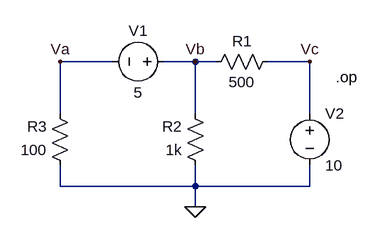
[diagram p0: schematic MNA_Voltage_Test.asc]
MNA_Voltage_Test.asc, the LTspice schematic file:
Version 4.1
SHEET 1 880 680
WIRE 112 96 32 96
WIRE 240 96 192 96
WIRE 272 96 240 96
WIRE 416 96 352 96
WIRE 32 176 32 96
WIRE 240 176 240 96
WIRE 416 176 416 96
WIRE 32 288 32 256
WIRE 240 288 240 256
WIRE 240 288 32 288
WIRE 416 288 416 256
WIRE 416 288 240 288
WIRE 240 320 240 288
FLAG 240 320 0
FLAG 32 96 Va
FLAG 240 96 Vb
FLAG 416 96 Vc
SYMBOL voltage 208 96 R90
WINDOW 0 -32 56 VBottom 2
WINDOW 3 32 56 VTop 2
WINDOW 123 0 0 Left 0
WINDOW 39 0 0 Left 0
SYMATTR InstName V1
SYMATTR Value 5
SYMBOL voltage 416 160 R0
WINDOW 123 0 0 Left 0
WINDOW 39 0 0 Left 0
SYMATTR InstName V2
SYMATTR Value 10
SYMBOL res 368 80 R90
WINDOW 0 0 56 VBottom 2
WINDOW 3 32 56 VTop 2
SYMATTR InstName R1
SYMATTR Value 500
SYMBOL res 256 272 R180
WINDOW 0 36 76 Left 2
WINDOW 3 36 40 Left 2
SYMATTR InstName R2
SYMATTR Value 1k
SYMBOL res 48 272 R180
WINDOW 0 36 76 Left 2
WINDOW 3 36 40 Left 2
SYMATTR InstName R3
SYMATTR Value 100
TEXT 456 120 Left 2 !.op

The netlist it stands for:
* MNA_Voltage_Test.asc
V1 Vb Va 5
V2 Vc 0 10
R1 Vc Vb 500
R2 0 Vb 1k
R3 0 Va 100
.op
.backanno
.end